# EAGLE schematic Schematic (EAGLE 6.3)
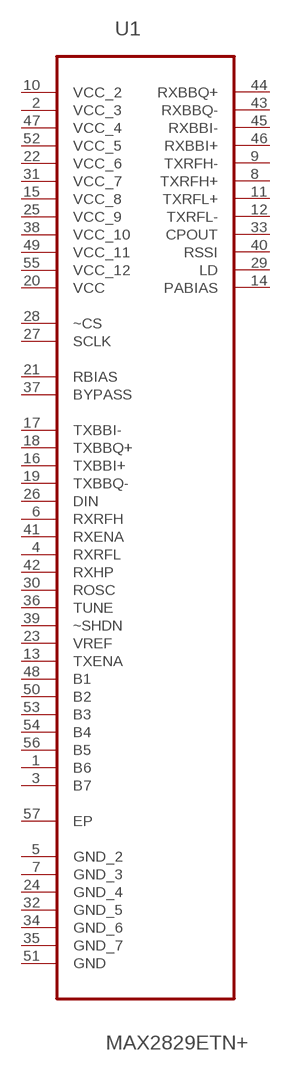
[diagram p0: schematic, sheet 1]

## Parts
U1  MAX2829ETN+  [QFN50P800X800X80-57N]
Unconnected: U1.1(B6) U1.3(B7) U1.4(RXRFL) U1.5(GND_2) U1.6(RXRFH) U1.7(GND_3) U1.8(TXRFH+) U1.9(TXRFH-) U1.11(TXRFL+) U1.12(TXRFL-) U1.13(TXENA) U1.14(PABIAS) U1.16(TXBBI+) U1.17(TXBBI-) U1.18(TXBBQ+) U1.19(TXBBQ-) U1.21(RBIAS) U1.23(VREF) U1.24(GND_4) U1.26(DIN) U1.27(SCLK) U1.28(~CS) U1.29(LD) U1.30(ROSC) U1.32(GND_5) U1.33(CPOUT) U1.34(GND_6) U1.35(GND_7) U1.36(TUNE) U1.37(BYPASS) U1.39(~SHDN) U1.40(RSSI) U1.41(RXENA) U1.42(RXHP) U1.43(RXBBQ-) U1.44(RXBBQ+) U1.45(RXBBI-) U1.46(RXBBI+) U1.48(B1) U1.50(B2) U1.51(GND) U1.53(B3) U1.54(B4) U1.56(B5) U1.57(EP)

## Power pins joined to a net without a drawn wire
VCC: U1.20(VCC)
VCC_2: U1.10(VCC_2)
VCC_3: U1.2(VCC_3)
VCC_4: U1.47(VCC_4)
VCC_5: U1.52(VCC_5)
VCC_6: U1.22(VCC_6)
VCC_7: U1.31(VCC_7)
VCC_8: U1.15(VCC_8)
VCC_9: U1.25(VCC_9)
VCC_10: U1.38(VCC_10)
VCC_11: U1.49(VCC_11)
VCC_12: U1.55(VCC_12)

## Library data of the parts
U1 = Maxim_By_element14_Batch_1:MAX2829ETN+: Single-/Dual-Band 802.11a/b/g World-Band Transceiver ICs; MPN: MAX2829ETN+; OC_FARNELL: -; OC_NEWARK: 74R8617; PACKAGE: TQFN-56; SUPPLIER: Maxim